# EAGLE schematic mainboard (EAGLE 5.11)
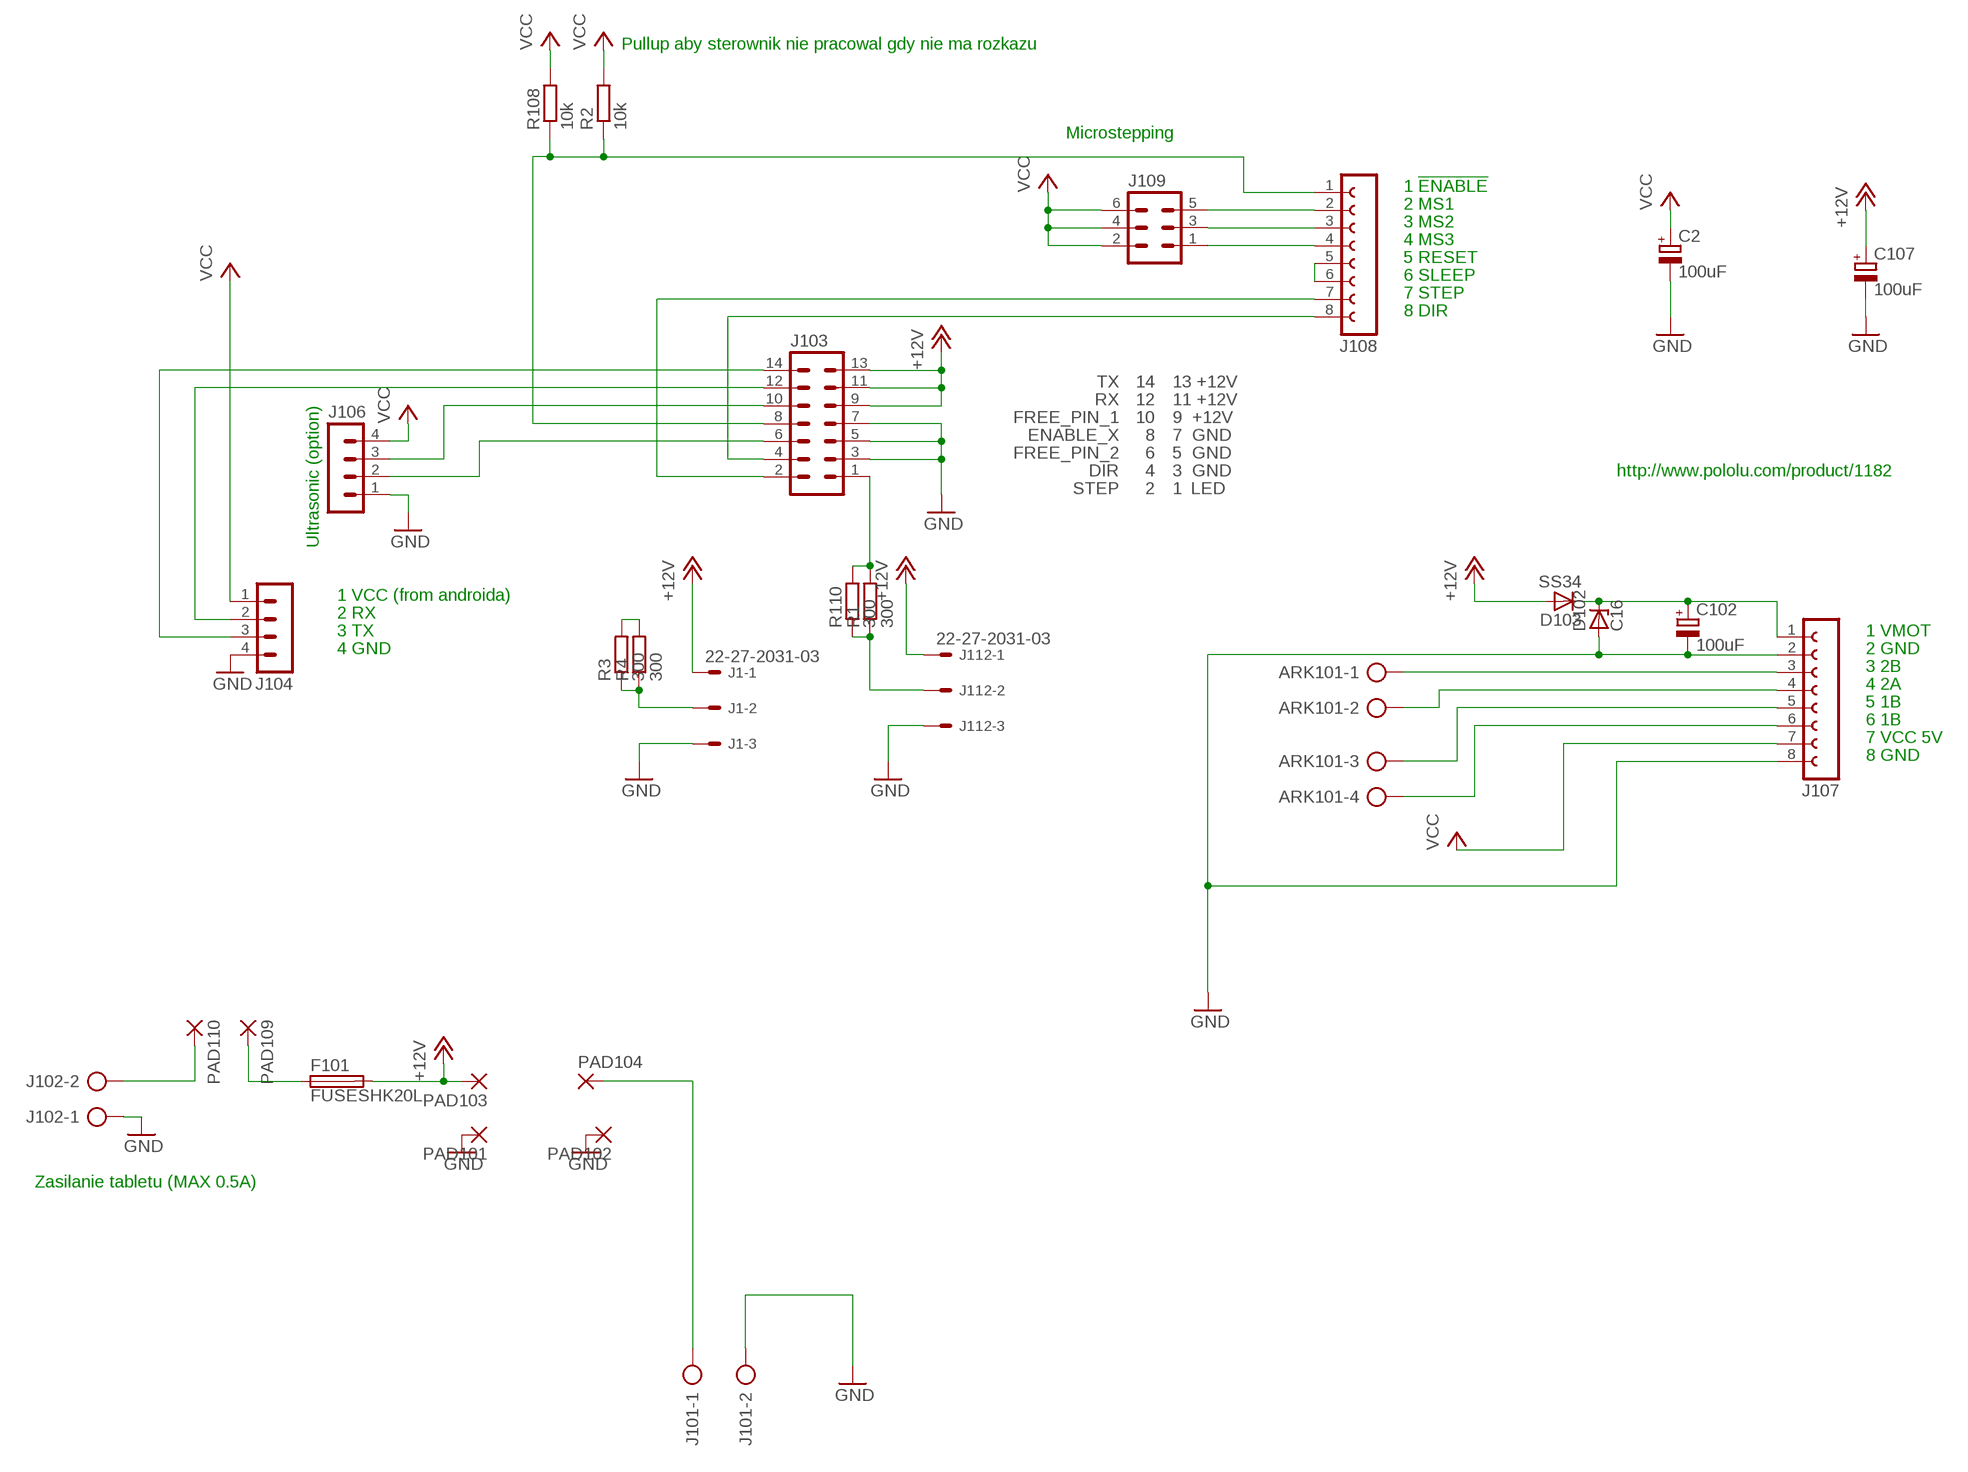
[diagram p0: schematic, sheet 1]

## Parts
ARK101  AK300/4  [AK300/4]
C2  100uF  CPOL-EUE5-10.5  [E5-10,5]
C102  100uF  CPOL-EUE5-10.5  [E5-10,5]
C107  100uF  CPOL-EUE5-8.5  [E5-8,5]
D102  C16  ZENER-DIODESOD80C  [SOD80C]
D103  SS34  BYS10  [SOD106A]
F101  FUSESHK20L  [SHK20L]
J1  22-27-2031-03  [6410-03]
J101  AK300/2  [AK300/2]
J102  AK300/2  [AK300/2]
J103  ML14  [ML14]
J104  MA04-1  [MA04-1]
J106  MA04-1  [MA04-1]
J107  FE08-1  [FE08]
J108  FE08-1  [FE08]
J109  MA03-2  [MA03-2]
J112  22-27-2031-03  [6410-03]
PAD101  3,17/1,1  [3,17/1,1]
PAD102  3,17/1,1  [3,17/1,1]
PAD103  3,17/1,1  [3,17/1,1]
PAD104  3,17/1,1  [3,17/1,1]
PAD109  3,81/1,3  [3,81/1,3]
PAD110  3,81/1,3  [3,81/1,3]
R1  300  R-EU_0207/12  [0207/12]
R2  10k  R-EU_0207/12  [0207/12]
R3  300  RES0805  [0805]
R4  300  R-EU_0207/12  [0207/12]
R108  10k  RES0805  [0805]
R110  300  RES0805  [0805]

## Nets
+12V [VCC12V]: C107.+ D103.A F101.2A J1.1 J103.9 J103.11 J103.13 J112.1 PAD103.1(P)
GND [Ground]: C2.- C102.- C107.- D102.A J1.3 J101.2 J102.1 J103.3 J103.5 J103.7 J104.4 J106.1 J107.2 J107.8 J112.3 PAD101.1(P) PAD102.1(P)
JUMPER101: J103.8 J108.1 R2.1 R108.1
MISO: J103.4 J108.8
N$1: J103.1 R1.2 R110.2
N$2 [VCC12V]: J101.1 PAD104.1(P)
N$3: J103.2 J108.7
N$4: J112.2 R1.1 R110.1
N$5: J103.10 J106.3
N$6: J103.6 J106.2
N$7 [VCC12V]: J102.2 PAD110.1(P)
N$8 [VCC12V]: F101.1A PAD109.1(P)
N$9: J1.2 R3.1 R4.1
N$10: R3.2 R4.2
N$17 [MOTOR]: ARK101.1 J107.3
N$18 [MOTOR]: ARK101.2 J107.4
N$19 [MOTOR]: ARK101.3 J107.5
N$20: ARK101.4 J107.6
N$24: J108.5 J108.6
N$35: J108.2 J109.5
N$39: J108.3 J109.3
N$40: J108.4 J109.1
N$43 [VCC12V]: C102.+ D102.C D103.K J107.1
SCL: J103.12 J104.2
SDA: J103.14 J104.3
VCC: C2.+ J104.1 J106.4 J107.7 J109.2 J109.4 J109.6 R2.2 R108.2

## Notes on the sheet
- Pullup aby sterownik nie pracowal gdy nie ma rozkazu
- Microstepping
- 1 !ENABLE
- 2 MS1
- 3 MS2
- 4 MS3
- 5 RESET
- 6 SLEEP
- 7 STEP
- 8 DIR
- TX | 14 | 13 +12V
- RX | 12 | 11 +12V
- FREE_PIN_1 | 10 | 9  +12V
- ENABLE_X | 8 | 7  GND
- FREE_PIN_2 | 6 | 5  GND
- DIR | 4 | 3  GND | http://www.pololu.com/product/1182
- STEP | 2 | 1 | LED
- Ultrasonic (option)
- 1 VCC (from androida)
- 2 RX
- 3 TX | 1 VMOT
- 4 GND | 2 GND
- 3 2B
- 4 2A
- 5 1B
- 6 1B
- 7 VCC 5V
- 8 GND
- Zasilanie tabletu (MAX 0.5A)

## Library data of the parts
ARK101 = con-ptr500:AK300/4: CONNECTOR; OC_FARNELL: unknown; OC_NEWARK: unknown
C2 C102 C107 = rcl:CPOL-EU: POLARIZED CAPACITOR, European symbol
D102 = diode:ZENER-DIODE: Z-Diode
D103 = telefunken:BYS10: DIODE; MPN: BYS10/45; OC_FARNELL: 9549188; OC_NEWARK: 96K7236
F101 = fuse:FUSE: Fuse; OC_FARNELL: unknown; OC_NEWARK: unknown
J1 J112 = con-molex:22-?-03: CONNECTOR wire to board 2.54 mm (.1 inch) pitch header; OC_FARNELL: unknown; OC_NEWARK: unknown
J101 J102 = con-ptr500:AK300/2: CONNECTOR; OC_FARNELL: unknown; OC_NEWARK: unknown
J103 = con-ml:ML14: HARTING; OC_FARNELL: unknown; OC_NEWARK: unknown
J104 J106 = con-lstb:MA04-1: PIN HEADER; OC_FARNELL: unknown; OC_NEWARK: unknown
J107 J108 = con-lsta:FE08-1: FEMALE HEADER; OC_FARNELL: unknown; OC_NEWARK: unknown
J109 = con-lstb:MA03-2: PIN HEADER; OC_FARNELL: unknown; OC_NEWARK: unknown
PAD101-PAD104 = wirepad:3,17/1,1: THROUGH-HOLE PAD
PAD109 PAD110 = wirepad:3,81/1,3: THROUGH-HOLE PAD
R1 R2 R4 = rcl:R-EU_: RESISTOR, European symbol
R3 R108 R110 = barobot:RES

## Net classes
0 default: width 0.381 mm
1 VCC12V: width 1.778 mm, drill 1.27 mm, clearance 0.508 mm
2 Ground: width 0.508 mm, drill 0.508 mm
3 MOTOR: width 0.813 mm